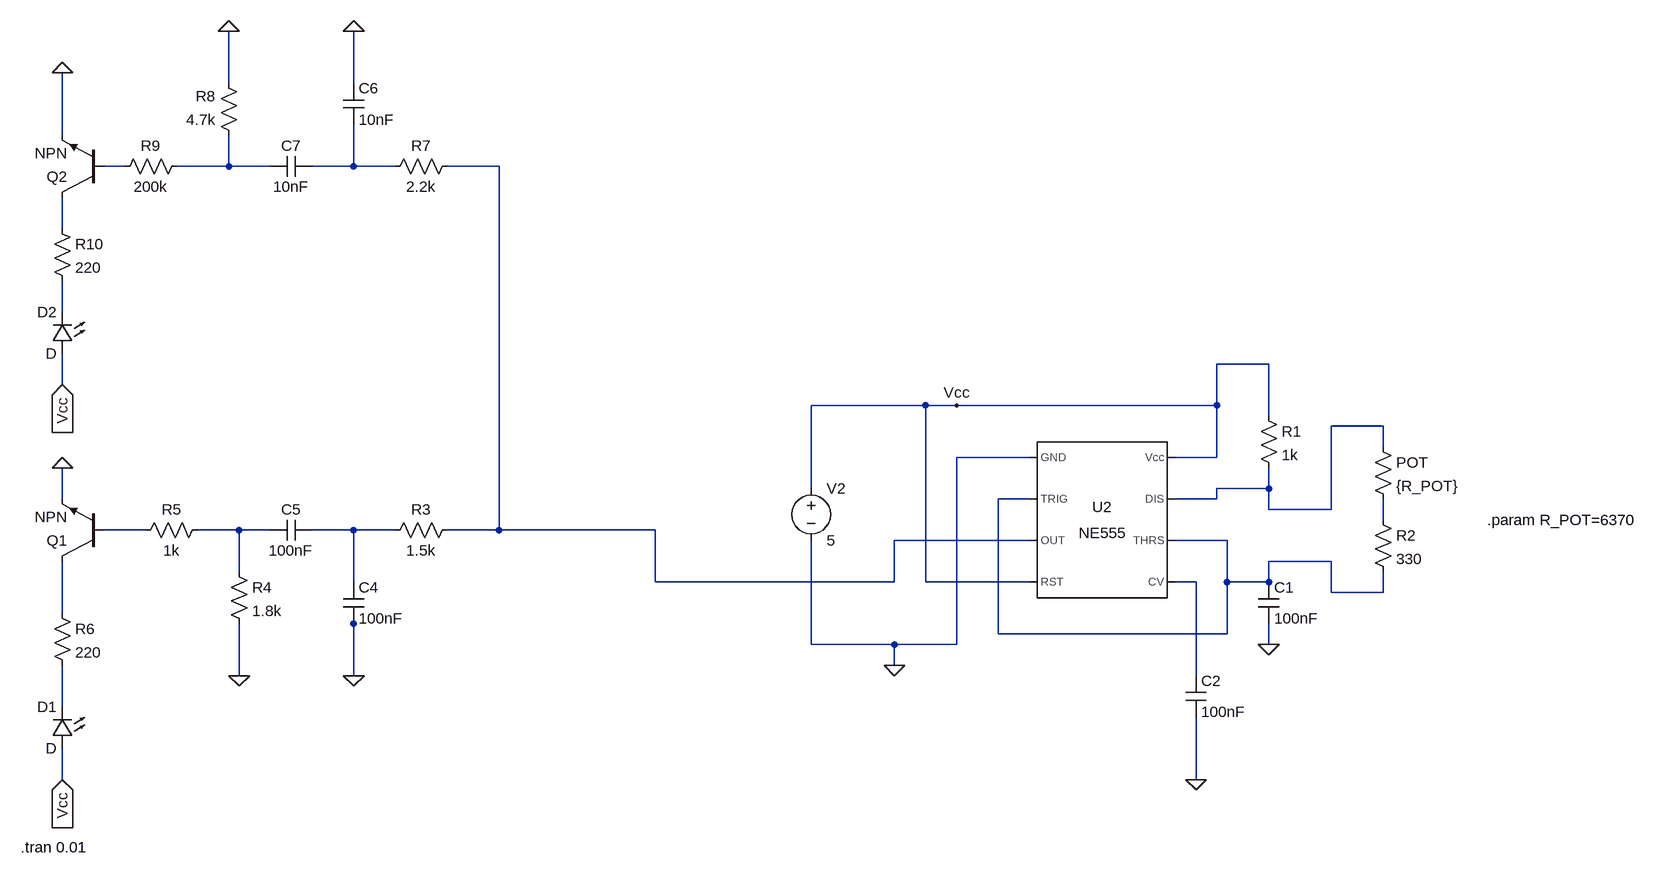
[diagram p0: schematic Trabajo_Electronica.asc]
Trabajo_Electronica.asc, the LTspice schematic file:
Version 4.1
SHEET 1 1888 712
WIRE -608 -480 -608 -560
WIRE -416 -480 -416 -560
WIRE -864 -400 -864 -496
WIRE -768 -352 -800 -352
WIRE -608 -352 -608 -400
WIRE -608 -352 -688 -352
WIRE -544 -352 -608 -352
WIRE -416 -352 -416 -416
WIRE -416 -352 -480 -352
WIRE -352 -352 -416 -352
WIRE -192 -352 -272 -352
WIRE -864 -256 -864 -304
WIRE -864 -128 -864 -176
WIRE 992 -48 912 -48
WIRE -864 -16 -864 -64
WIRE 464 16 288 16
WIRE 512 16 464 16
WIRE 912 16 912 -48
WIRE 912 16 512 16
WIRE 992 32 992 -48
WIRE 1168 48 1088 48
WIRE 1168 80 1168 48
WIRE 624 96 512 96
WIRE 912 96 912 16
WIRE 912 96 848 96
WIRE 288 144 288 16
WIRE 992 144 992 112
WIRE 992 144 912 144
WIRE -864 160 -864 112
WIRE 624 160 576 160
WIRE 912 160 912 144
WIRE 912 160 848 160
WIRE 992 176 992 144
WIRE 1088 176 1088 48
WIRE 1088 176 992 176
WIRE 1168 192 1168 160
WIRE -736 208 -800 208
WIRE -592 208 -656 208
WIRE -544 208 -592 208
WIRE -416 208 -480 208
WIRE -352 208 -416 208
WIRE -192 208 -192 -352
WIRE -192 208 -272 208
WIRE 48 208 -192 208
WIRE 624 224 416 224
WIRE 928 224 848 224
WIRE 1088 256 992 256
WIRE -592 272 -592 208
WIRE -416 288 -416 208
WIRE 48 288 48 208
WIRE 416 288 416 224
WIRE 416 288 48 288
WIRE 464 288 464 16
WIRE 624 288 464 288
WIRE 880 288 848 288
WIRE 928 288 928 224
WIRE 992 288 992 256
WIRE 992 288 928 288
WIRE 1088 304 1088 256
WIRE 1168 304 1168 272
WIRE 1168 304 1088 304
WIRE -864 336 -864 256
WIRE -416 352 -416 336
WIRE 576 368 576 160
WIRE 928 368 928 288
WIRE 928 368 576 368
WIRE 288 384 288 224
WIRE 416 384 288 384
WIRE 512 384 512 96
WIRE 512 384 416 384
WIRE 992 384 992 352
WIRE 416 416 416 384
WIRE -592 432 -592 352
WIRE -416 432 -416 352
WIRE 880 432 880 288
WIRE -864 480 -864 416
WIRE -864 592 -864 544
WIRE 880 592 880 496
FLAG -592 432 0
FLAG -416 432 0
FLAG -608 -560 0
FLAG -864 -496 0
FLAG -864 112 0
FLAG -864 -16 Vcc
IOPIN -864 -16 In
FLAG -864 592 Vcc
IOPIN -864 592 In
FLAG 416 416 0
FLAG 992 384 0
FLAG 512 16 Vcc
FLAG 880 592 0
FLAG -416 -560 0
SYMBOL res -256 192 R90
WINDOW 0 0 56 VBottom 2
WINDOW 3 32 56 VTop 2
SYMATTR InstName R3
SYMATTR Value 1.5k
SYMBOL cap -480 192 R90
WINDOW 0 0 32 VBottom 2
WINDOW 3 32 32 VTop 2
SYMATTR InstName C5
SYMATTR Value 100nF
SYMBOL res -640 192 R90
WINDOW 0 0 56 VBottom 2
WINDOW 3 32 56 VTop 2
SYMATTR InstName R5
SYMATTR Value 1k
SYMBOL cap -432 288 R0
SYMATTR InstName C4
SYMATTR Value 100nF
SYMBOL res -608 256 R0
SYMATTR InstName R4
SYMATTR Value 1.8k
SYMBOL npn -800 256 R180
SYMATTR InstName Q1
SYMBOL res -880 320 R0
SYMATTR InstName R6
SYMATTR Value 220
SYMBOL res -256 -368 R90
WINDOW 0 0 56 VBottom 2
WINDOW 3 32 56 VTop 2
SYMATTR InstName R7
SYMATTR Value 2.2k
SYMBOL cap -432 -480 R0
SYMATTR InstName C6
SYMATTR Value 10nF
SYMBOL cap -480 -368 R90
WINDOW 0 0 32 VBottom 2
WINDOW 3 32 32 VTop 2
SYMATTR InstName C7
SYMATTR Value 10nF
SYMBOL res -592 -384 R180
WINDOW 0 36 76 Left 2
WINDOW 3 36 40 Left 2
SYMATTR InstName R8
SYMATTR Value 4.7k
SYMBOL res -784 -336 R270
WINDOW 0 32 56 VTop 2
WINDOW 3 0 56 VBottom 2
SYMATTR InstName R9
SYMATTR Value 200k
SYMBOL npn -800 -304 R180
SYMATTR InstName Q2
SYMBOL res -880 -272 R0
SYMATTR InstName R10
SYMATTR Value 220
SYMBOL LED -848 -64 R180
WINDOW 0 24 64 Left 2
WINDOW 3 24 0 Left 2
SYMATTR InstName D2
SYMBOL LED -848 544 R180
WINDOW 0 24 64 Left 2
WINDOW 3 24 0 Left 2
SYMATTR InstName D1
SYMBOL Misc\\NE555 736 192 R0
SYMATTR InstName U2
SYMBOL voltage 288 128 R0
SYMATTR InstName V2
SYMATTR Value 5
SYMBOL cap 976 288 R0
SYMATTR InstName C1
SYMATTR Value 100nF
SYMBOL res 976 16 R0
SYMATTR InstName R1
SYMATTR Value 1k
SYMBOL res 1152 176 R0
SYMATTR InstName R2
SYMATTR Value 330
SYMBOL res 1152 64 R0
SYMATTR InstName POT
SYMATTR Value {R_POT}
SYMBOL cap 864 432 R0
SYMATTR InstName C2
SYMATTR Value 100nF
TEXT -928 696 Left 2 !.tran 0.01
TEXT 1328 192 Left 2 !.param R_POT=6370

The netlist it stands for:
* Trabajo_Electronica.asc
R3 N004 N012 1.5k
C5 N012 N011 100nF
R5 N011 N010 1k
C4 N012 0 100nF
R4 N011 0 1.8k
Q1 N014 N010 0 0 NPN
R6 N014 N015 220
R7 N004 N003 2.2k
C6 0 N003 10nF
C7 N003 N002 10nF
R8 N002 0 4.7k
R9 N001 N002 200k
Q2 N005 N001 0 0 NPN
R10 N005 N006 220
D2 Vcc N006 D
D1 Vcc N015 D
X§U2 0 N008 N004 Vcc N013 N008 N007 Vcc NE555  ; pins GND TRIG OUT RST CV THRS DIS Vcc
V2 Vcc 0 5
C1 N008 0 100nF
R1 Vcc N007 1k
R2 N009 N008 330
R§POT N007 N009 {R_POT}
C2 N013 0 100nF
.model D D
.lib standard.dio
.model NPN NPN
.model PNP PNP
.lib standard.bjt
.tran 0.01
.param R_POT=6370
.lib NE555.sub
.backanno
.end